# EAGLE design openSX70-bench (EAGLE 8.6.3)
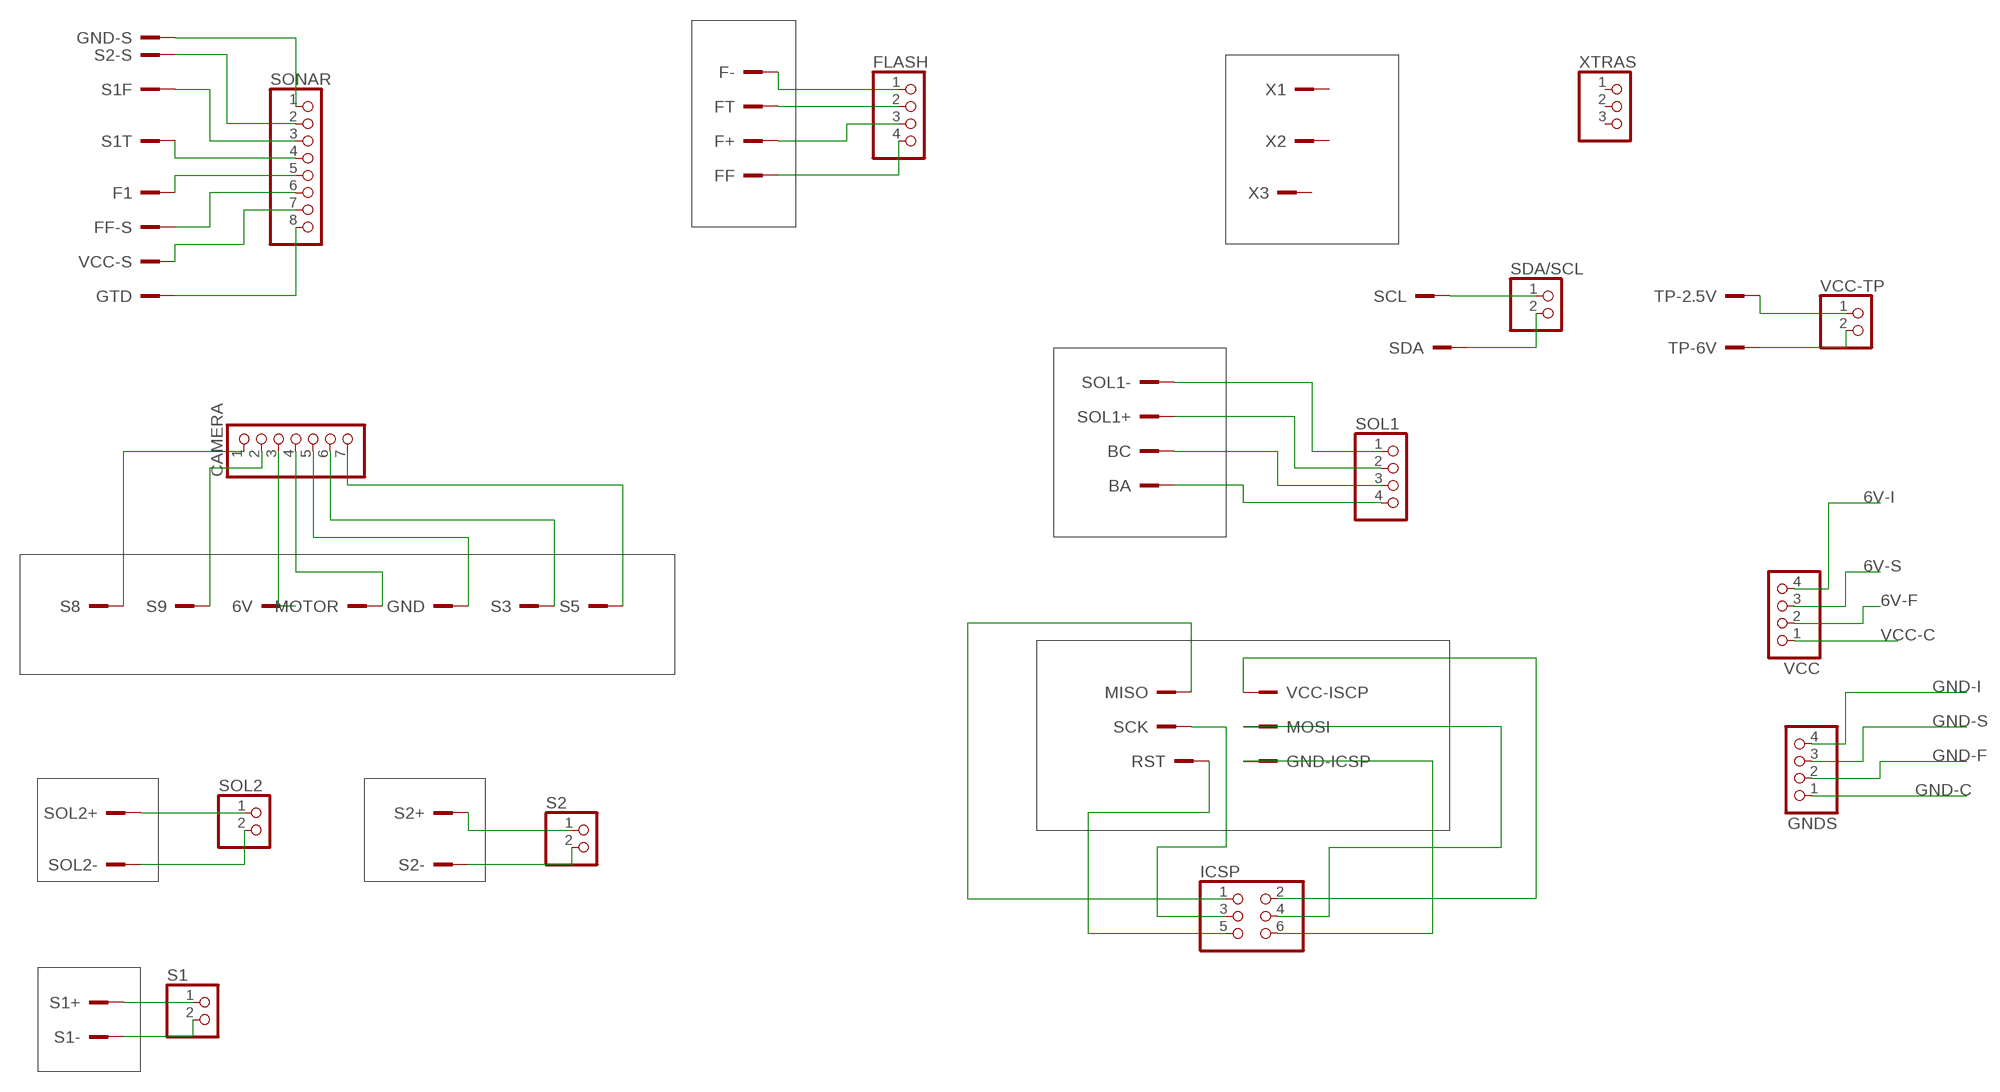
[diagram p0: schematic, sheet 1]

## Parts
6V  PINHEAD  [1X01]
BA  PINHEAD  [1X01]
BC  PINHEAD  [1X01]
CAMERA  PINHD-1X7  [1X07]
F1  PINHEAD  [1X01]
F+  PINHEAD  [1X01]
F-  PINHEAD  [1X01]
FF  PINHEAD  [1X01]
FF-S  PINHEAD  [1X01]
FLASH  PINHD-1X4  [1X04]
FT  PINHEAD  [1X01]
GND  PINHEAD  [1X01]
GND-ICSP  PINHEAD  [1X01]
GND-S  PINHEAD  [1X01]
GNDS  PINHD-1X4  [1X04]
GTD  PINHEAD  [1X01]
ICSP  PINHD-2X3  [2X03]
MISO  PINHEAD  [1X01]
MOSI  PINHEAD  [1X01]
MOTOR  PINHEAD  [1X01]
RST  PINHEAD  [1X01]
S1  PINHD-1X2  [1X02]
S1+  PINHEAD  [1X01]
S1-  PINHEAD  [1X01]
S1F  PINHEAD  [1X01]
S1T  PINHEAD  [1X01]
S2  PINHD-1X2  [1X02]
S2+  PINHEAD  [1X01]
S2-  PINHEAD  [1X01]
S2-S  PINHEAD  [1X01]
S3  PINHEAD  [1X01]
S5  PINHEAD  [1X01]
S8  PINHEAD  [1X01]
S9  PINHEAD  [1X01]
SCK  PINHEAD  [1X01]
SCL  PINHEAD  [1X01]
SDA  PINHEAD  [1X01]
SDA/SCL  PINHD-1X2  [1X02]
SOL1  PINHD-1X4  [1X04]
SOL1+  PINHEAD  [1X01]
SOL1-  PINHEAD  [1X01]
SOL2  PINHD-1X2  [1X02]
SOL2+  PINHEAD  [1X01]
SOL2-  PINHEAD  [1X01]
SONAR  PINHD-1X8  [1X08]
TP-2.5V  PINHEAD  [1X01]
TP-6V  PINHEAD  [1X01]
VCC  PINHD-1X4  [1X04]
VCC-ISCP  PINHEAD  [1X01]
VCC-S  PINHEAD  [1X01]
VCC-TP  PINHD-1X2  [1X02]
X1  PINHEAD  [1X01]
X2  PINHEAD  [1X01]
X3  PINHEAD  [1X01]
XTRAS  PINHD-1X3  [1X03]

## Nets
6V-F: F+.1(KL) FLASH.3 VCC.2
6V-I: ICSP.2 VCC-ISCP.1(KL) VCC.4
6V-S: SONAR.7 VCC-S.1(KL) VCC.3
GND-C: CAMERA.5 GND.1(KL) GNDS.1
GND-F: F-.1(KL) FLASH.1 GNDS.2
GND-I: GND-ICSP.1(KL) GNDS.4 ICSP.6
GND-S: GND-S.1(KL) GNDS.3 SONAR.1
N$1: CAMERA.1 S8.1(KL)
N$2: CAMERA.2 S9.1(KL)
N$4: CAMERA.4 MOTOR.1(KL)
N$6: CAMERA.6 S3.1(KL)
N$7: CAMERA.7 S5.1(KL)
N$8: ICSP.1 MISO.1(KL)
N$9: ICSP.3 SCK.1(KL)
N$10: ICSP.5 RST.1(KL)
N$12: ICSP.4 MOSI.1(KL)
N$15: S2-S.1(KL) SONAR.2
N$16: S1F.1(KL) SONAR.3
N$17: S1T.1(KL) SONAR.4
N$18: F1.1(KL) SONAR.5
N$19: FF-S.1(KL) SONAR.6
N$21: GTD.1(KL) SONAR.8
N$23: FLASH.2 FT.1(KL)
N$25: FF.1(KL) FLASH.4
N$26: SOL1-.1(KL) SOL1.1
N$27: SOL1+.1(KL) SOL1.2
N$28: BC.1(KL) SOL1.3
N$29: BA.1(KL) SOL1.4
N$30: SCL.1(KL) SDA/SCL.1
N$31: SDA.1(KL) SDA/SCL.2
N$32: TP-2.5V.1(KL) VCC-TP.1
N$33: TP-6V.1(KL) VCC-TP.2
N$34: SOL2+.1(KL) SOL2.1
N$35: SOL2-.1(KL) SOL2.2
N$36: S1+.1(KL) S1.1
N$37: S1-.1(KL) S1.2
N$38: S2+.1(KL) S2.1
N$39: S2-.1(KL) S2.2
VCC-C: 6V.1(KL) CAMERA.3 VCC.1
Unconnected: X1.1(KL) X2.1(KL) X3.1(KL) XTRAS.1 XTRAS.2 XTRAS.3

## Library data of the parts
6V BA BC F1 F+ F- FF FF-S FT GND GND-ICSP GND-S GTD MISO MOSI MOTOR RST S1+ S1- S1F S1T S2+ S2- S2-S S3 S5 S8 S9 SCK SCL SDA SOL1+ SOL1- SOL2+ SOL2- TP-2.5V TP-6V VCC-ISCP VCC-S X1-X3 = openSX70:PINHEAD
CAMERA = pinhead:PINHD-1X7: PIN HEADER
FLASH GNDS SOL1 VCC = pinhead:PINHD-1X4: PIN HEADER
ICSP = pinhead:PINHD-2X3: PIN HEADER
S1 S2 SDA/SCL SOL2 VCC-TP = pinhead:PINHD-1X2: PIN HEADER
SONAR = pinhead:PINHD-1X8: PIN HEADER
XTRAS = pinhead:PINHD-1X3: PIN HEADER

## Net classes
0 default: width 0.61 mm

## Board
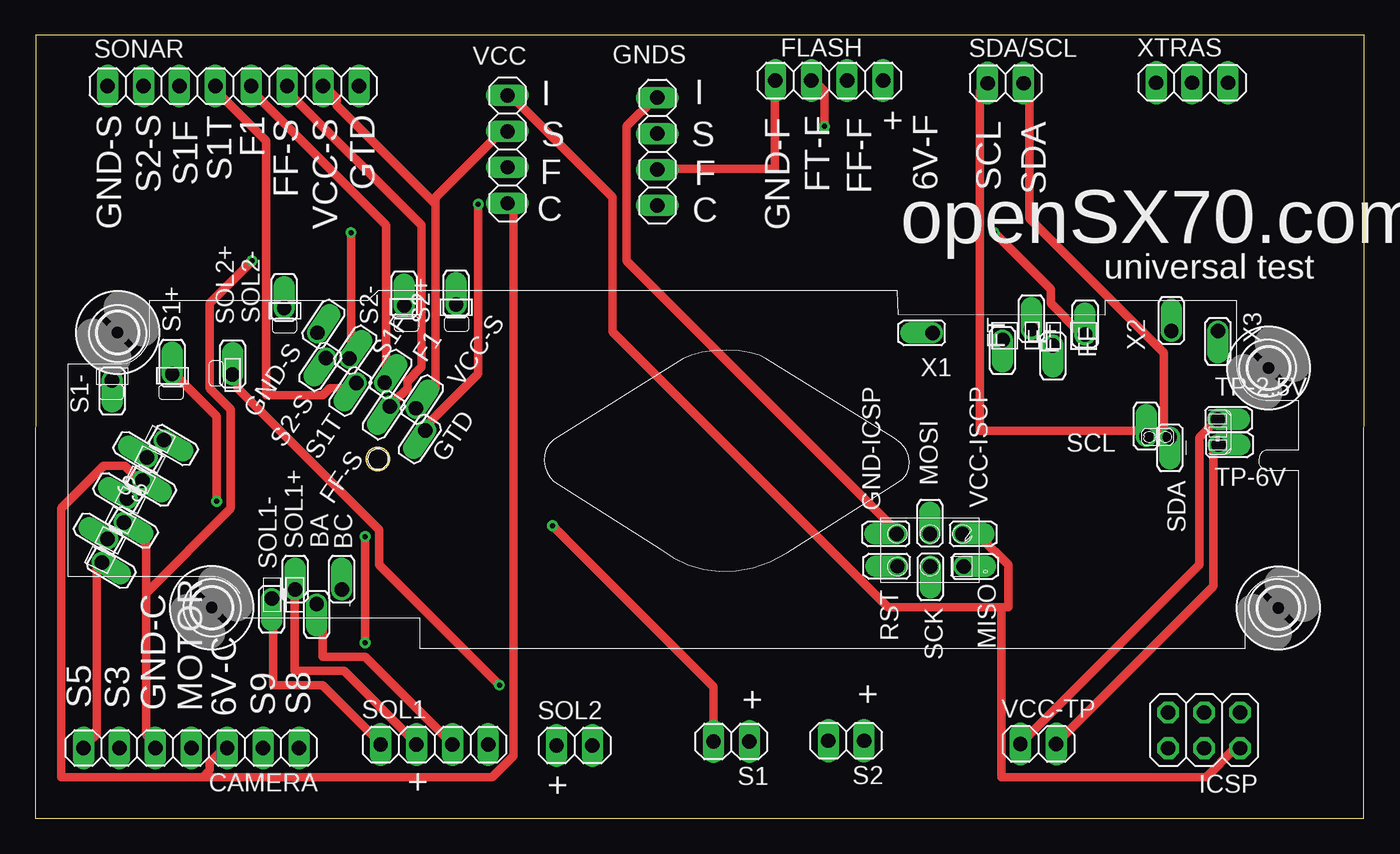
[diagram p1: board, top side]
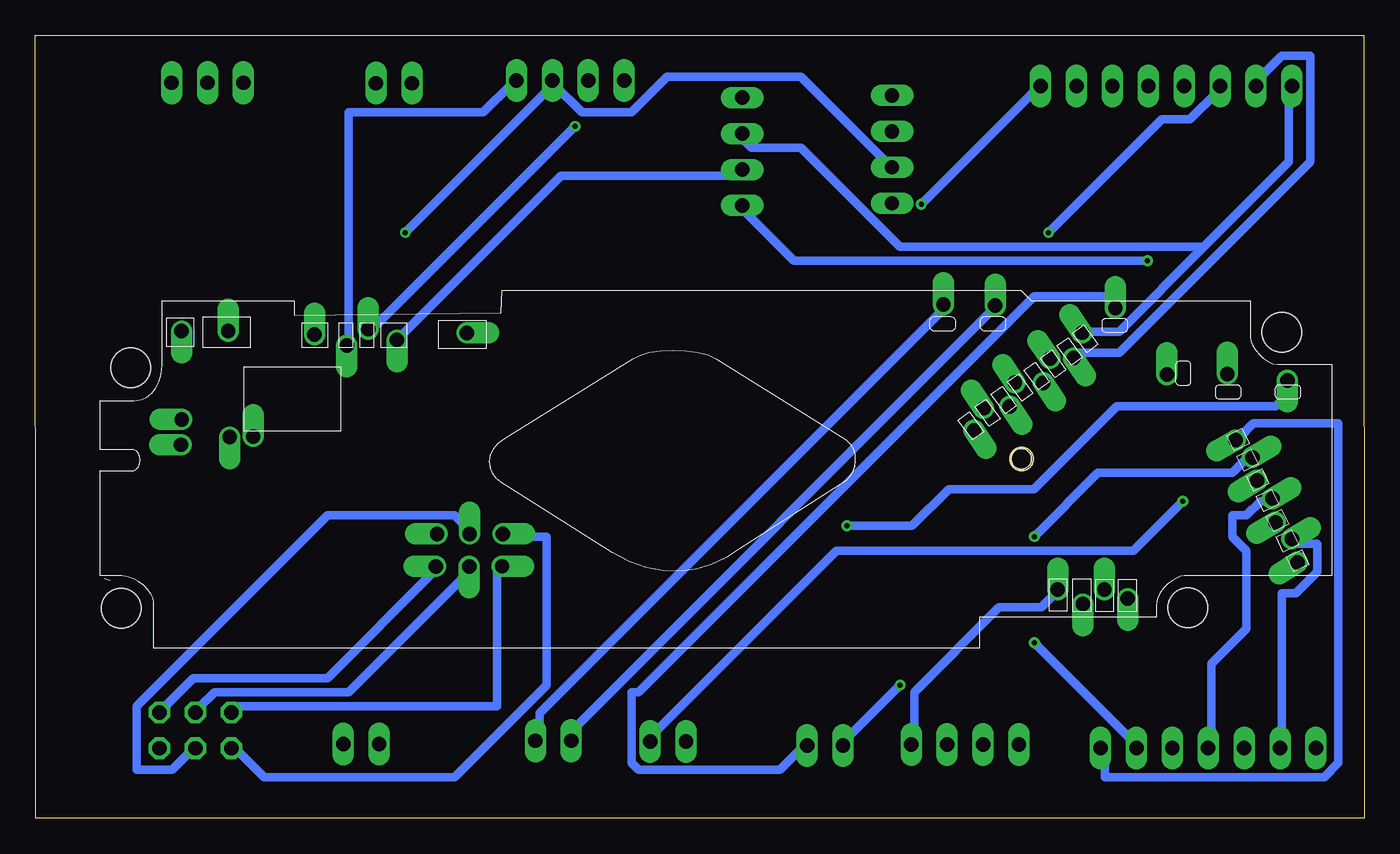
[diagram p2: board, bottom side, seen from below]

Size 93.99 x 55.37 mm. Coordinates in mm from the lower left corner, seen from the top.
Outline: 0,0 93.96,0 93.99,55.37 0.03,55.37 0,0
Outline: circle at 24.23,25.42 radius 0.81
Copper layers (1*16): Top 0.035mm / dielectric 1.5mm / Bottom 0.035mm
Design rules "default": minimum track width 6mil, minimum drill 0.35mm, track to track 6mil, track to pad 6mil, pad to pad 6mil, via to via 6mil, smd to smd 6mil, copper to edge 40mil, drill to drill 6mil, minimum pad ring 10mil, minimum via ring 8mil, stop-mask expansion 4mil, vias tented up to drill 0mil, thermal gap 10mil

### Footprints (pad centres in the part's own frame; a part is rotated, then mirrored left to right if it is on the bottom)
1X01 = drill 1.016 offset: 1 0,0
1X07 = drill 1.016 long: 1 -7.62,0; 2 -5.08,0; 3 -2.54,0; 4 0,0; 5 2.54,0; 6 5.08,0; 7 7.62,0
1X04 = drill 1.016 long: 1 -3.81,0; 2 -1.27,0; 3 1.27,0; 4 3.81,0
2X03 = drill 1.016 octagon: 1 -2.54,-1.27; 2 -2.54,1.27; 3 0,-1.27; 4 0,1.27; 5 2.54,-1.27; 6 2.54,1.27
1X02 = drill 1.016 long: 1 -1.27,0; 2 1.27,0
1X08 = drill 1.016 long: 1 -8.89,0; 2 -6.35,0; 3 -3.81,0; 4 -1.27,0; 5 1.27,0; 6 3.81,0; 7 6.35,0; 8 8.89,0
2,8 = hole 2.8: 0,0
1X03 = drill 1.016 long: 1 -2.54,0; 2 0,0; 3 2.54,0

### Placement (x,y rotation side)
6V  7.58,23.9 329 top
BA  21.68,16.18 90 top
BC  19.9,15.16 270 top
CAMERA  11.03,4.99 180 top
F1  24.7,30.82 56 top
F+  74.25,34.21 90 top
F-  68.41,33.83 270 top
FF  71.97,33.45 270 top
FF-S  25.06,29.13 236 top
FLASH  56.15,52.17 0 top
FT  70.44,34.59 90 top
GND  6.28,20.94 329 top
GND-ICSP  60.92,20.13 180 top
GND-S  19.96,34.35 56 top
GNDS  44,47.16 90 top
GTD  27.6,27.45 236 top
ICSP  82.68,6.24 180 top
MISO  65.68,17.82 0 top
MOSI  63.28,20.13 90 top
MOTOR  6.48,22.62 149 top
RST  60.98,17.84 180 top
S1  49.23,5.44 180 top
S1+  9.68,31.44 90 top
S1-  5.42,30.98 270 top
S1F  22.21,32.53 56 top
S1T  22.7,30.8 236 top
S2  57.36,5.5 180 top
S2+  29.76,36.34 90 top
S2-  26.09,36.26 90 top
S2-S  20.56,32.56 236 top
S3  5.1,19.77 149 top
S5  4.71,18.1 329 top
S8  9.1,26.75 330 top
S9  7.9,25.53 149 top
SCK  63.31,17.83 270 top
SCL  78.58,27.01 90 top
SDA  80.25,26.96 270 top
SDA/SCL  68.63,51.99 0 top
SOL1  28.23,5.22 0 top
SOL1+  18.37,16.18 90 top
SOL1-  16.72,15.54 270 top
SOL2  38.13,5.16 0 top
SOL2+  13.95,31.39 90 top
SOL2-  17.6,36.09 90 top
SONAR  14,51.79 0 top
TP-2.5V  83.64,28.22 0 top
TP-6V  83.69,26.42 0 top
U$1  [2,8]  12.47,14.91 0 top
U$2  [2,8]  5.82,34.37 0 top
U$3  [2,8]  87.23,31.86 0 top
U$4  [2,8]  87.92,14.88 0 top
VCC  33.4,47.32 90 top
VCC-ISCP  65.58,20.12 0 top
VCC-S  26.92,29.01 56 top
VCC-TP  70.94,5.27 0 top
X1  63.46,34.34 180 top
X2  80.35,34.47 90 top
X3  83.65,34.47 270 top
XTRAS  81.82,52.02 0 top

### Tracks (layer width: path | path; a pad name or v marks a point on that pad's centre or on a via)
6V-F  (via drill 0.35)
  Top 0.61: v67.82,41.43 71.82,37.43 71.82,36.43 73.82,34.43 F+.1
  Bottom 0.61: 57.32,51.93 55.32,49.93 51.82,49.93 49.32,52.43 39.82,52.43 33.82,46.43 VCC.2 | 57.32,51.93 v67.82,41.43 | 57.32,51.93 FLASH.3
6V-I
  Top 0.61: 68.32,14.93 68.82,14.93 68.82,17.93 66.82,19.93 65.82,19.93 VCC-ISCP.1 | 68.32,14.93 60.32,14.93 40.82,34.43 40.82,43.93 33.82,50.93 VCC.4 | 68.32,14.93 68.32,2.93 82.82,2.93 84.82,4.93 ICSP.2
6V-S
  Top 0.61: 28.32,43.43 28.32,43.93 33.32,48.93 VCC.3 | 28.32,43.43 28.32,30.43 27.32,29.43 VCC-S.1 | 28.32,43.43 21.32,50.43 21.32,50.93 20.82,51.43 SONAR.7
GND-C  (via drill 0.35)
  Top 0.61: 7.82,15.93 7.82,19.43 6.32,20.93 GND.1 | 7.82,15.93 7.82,5.93 8.32,5.43 CAMERA.5 | v15.32,39.43 12.32,36.43 12.32,30.43 13.82,28.93 13.82,21.93 7.82,15.93
  Bottom 0.61: v15.32,39.43 40.32,39.43 43.82,42.93 GNDS.1
GND-F
  Top 0.61: GNDS.2 44.32,45.93 52.32,45.93 52.32,51.93 FLASH.1
  Bottom 0.61: F-.1 68.32,33.93 56.82,45.43 44.32,45.43 GNDS.2
GND-I
  Top 0.61: GND-ICSP.1 60.82,20.43 41.82,39.43 41.82,48.93 43.82,50.93 GNDS.4
  Bottom 0.61: ICSP.6 79.82,4.93 77.82,2.93 64.32,2.93 57.82,9.43 57.82,19.93 60.82,19.93 GND-ICSP.1
GND-S
  Bottom 0.61: 11.32,40.43 5.32,46.43 5.32,51.43 SONAR.1 | 11.32,40.43 17.32,34.43 19.82,34.43 GND-S.1 | 11.32,40.43 32.82,40.43 39.82,47.43 43.32,47.43 43.82,47.93 GNDS.3
N$1
  Bottom 0.61: CAMERA.1 18.32,4.93 18.32,2.93 2.82,2.93 1.82,3.93 1.82,27.93 7.82,27.93 8.82,26.93 S8.1
N$2  (via drill 0.35)
  Top 0.61: v23.32,19.93 v23.32,12.43
  Bottom 0.61: v23.32,12.43 16.32,5.43 CAMERA.2 | v23.32,19.93 18.82,24.43 9.32,24.43 8.32,25.43 S9.1
N$4
  Bottom 0.61: CAMERA.4 10.82,5.43 10.82,10.93 8.32,13.43 8.32,18.93 9.32,19.93 9.32,21.43 8.32,21.43 7.32,22.43 6.82,22.43 MOTOR.1
N$6
  Bottom 0.61: CAMERA.6 5.82,5.43 5.82,15.93 4.82,15.93 3.32,17.43 3.32,19.43 4.82,19.43 S3.1
N$7
  Top 0.61: CAMERA.7 3.82,5.43 4.32,5.93 4.32,17.93 S5.1
N$8
  Bottom 0.61: MISO.1 65.82,17.43 73.32,9.93 82.82,9.93 84.82,7.93 ICSP.1
N$9
  Bottom 0.61: SCK.1 63.32,17.43 71.82,8.93 81.32,8.93 82.32,7.93 ICSP.3
N$10
  Bottom 0.61: RST.1 61.32,17.43 61.32,7.93 79.82,7.93 ICSP.5
N$12
  Bottom 0.61: MOSI.1 63.32,20.43 64.32,21.43 73.32,21.43 86.82,7.93 86.82,3.43 84.32,3.43 82.82,4.93 ICSP.4
N$15
  Bottom 0.61: S2-S.1 20.32,32.93 17.32,32.93 3.82,46.43 3.82,53.93 5.82,53.93 7.82,51.93 SONAR.2
N$16  (via drill 0.35)
  Top 0.61: v22.32,41.43 22.32,32.93 S1F.1
  Bottom 0.61: v22.32,41.43 14.32,49.43 12.32,49.43 10.32,51.43 SONAR.3
N$17
  Top 0.61: S1T.1 22.32,30.43 20.82,30.43 20.32,29.93 16.32,29.93 16.32,47.93 12.82,51.43 SONAR.4
N$18
  Top 0.61: F1.1 24.82,30.93 24.82,41.93 15.32,51.43 SONAR.5
N$19
  Top 0.61: FF-S.1 25.32,29.43 26.32,30.43 26.32,30.93 27.32,31.93 27.32,41.93 17.82,51.43 SONAR.6
N$21  (via drill 0.35)
  Top 0.61: v31.32,43.43 31.32,31.43 27.82,27.93 GTD.1
  Bottom 0.61: v31.32,43.43 23.32,51.43 SONAR.8
N$23  (via drill 0.35)
  Top 0.61: v55.82,48.93 55.82,51.43 55.32,51.93 FLASH.2
  Bottom 0.61: v55.82,48.93 69.82,34.93 70.32,34.93 FT.1
N$25
  Bottom 0.61: FF.1 71.82,33.93 71.82,49.93 62.32,49.93 60.32,51.93 FLASH.4
N$26
  Top 0.61: SOL1.1 24.32,5.43 20.32,9.43 16.82,9.43 16.82,15.43 SOL1-.1
N$27
  Top 0.61: SOL1.2 26.82,5.43 21.82,10.43 18.32,10.43 18.32,15.93 SOL1+.1
N$28
  Top 0.61: SOL1.3 29.32,5.43 23.32,11.43 20.32,11.43 20.32,14.93 BC.1
N$29
  Bottom 0.61: BA.1 21.82,15.93 22.82,14.93 25.82,14.93 31.82,8.93 31.82,5.43 SOL1.4
N$30
  Top 0.61: SCL.1 78.32,27.43 66.82,27.43 66.82,51.43 67.32,51.93 SDA/SCL.1
N$31
  Top 0.61: SDA.1 79.82,27.43 79.82,32.93 70.32,42.43 70.32,51.93 SDA/SCL.2
N$32
  Top 0.61: VCC-TP.1 69.82,5.43 82.32,17.93 82.32,26.93 83.32,27.93 TP-2.5V.1
N$33
  Top 0.61: VCC-TP.2 72.32,5.43 83.32,16.43 83.32,25.93 TP-6V.1
N$34  (via drill 0.35)
  Top 0.61: v32.82,9.43 24.32,17.93 24.32,20.43 14.32,30.43 14.32,30.93 SOL2+.1
  Bottom 0.61: v32.82,9.43 36.82,5.43 SOL2.1
N$35
  Bottom 0.61: SOL2.2 39.82,4.93 41.32,3.43 51.32,3.43 51.82,3.93 51.82,8.93 51.32,8.93 23.32,36.93 18.32,36.93 17.82,36.43 SOL2-.1
N$36  (via drill 0.35)
  Top 0.61: v12.82,22.43 12.82,28.43 9.82,31.43 S1+.1
  Bottom 0.61: v12.82,22.43 16.32,18.93 37.32,18.93 50.32,5.93 S1.1
N$37  (via drill 0.35)
  Top 0.61: v36.58,20.7 47.96,9.31 S1.2
  Bottom 0.61: S1-.1 5.42,29.96 6.24,29.15 17.5,29.15 23.35,23.3 29.38,23.3 31.98,20.7 v36.58,20.7
N$38
  Bottom 0.61: S2+.1 29.82,35.93 58.32,7.43 58.32,5.93 S2.1
N$39
  Bottom 0.61: S2-.1 26.32,35.93 56.32,5.93 S2.2
VCC-C
  Top 0.61: 11.82,2.93 12.32,3.43 12.32,3.93 13.32,4.93 CAMERA.3 | 11.82,2.93 1.82,2.93 1.82,21.93 4.82,24.93 6.32,24.93 7.32,23.93 6V.1 | 11.82,2.93 32.32,2.93 33.82,4.43 33.82,43.43 VCC.1

### Text on the board
tPlace: I | I | GND-S | S2-S | S1F | S1T | F1 | FF-S | VCC-S | GTD | GND-F | FT-F | FF-F | 6V-F | SCL | SDA | + | S | S | F | F | C | C | openSX70.com | universal test | + | S5 | S3 | GND-C | MOTOR | 6V-C | S9 | S8 | + | + | +